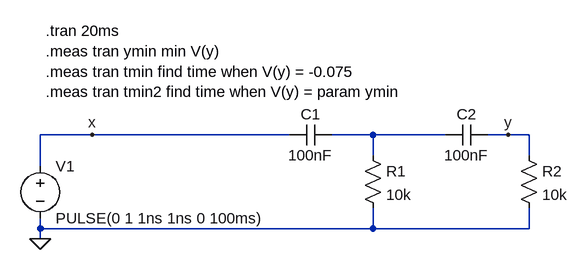
[diagram p0: schematic ltspice_high_high_series.asc]
ltspice_high_high_series.asc, the LTspice schematic file:
Version 4
SHEET 1 880 680
WIRE 16 112 -64 112
WIRE 320 112 16 112
WIRE 448 112 384 112
WIRE 560 112 448 112
WIRE 656 112 624 112
WIRE 688 112 656 112
WIRE 448 144 448 112
WIRE 688 144 688 112
WIRE -64 160 -64 112
WIRE -64 256 -64 240
WIRE 448 256 448 224
WIRE 448 256 -64 256
WIRE 688 256 688 224
WIRE 688 256 448 256
WIRE -64 272 -64 256
FLAG -64 272 0
FLAG 656 112 y
FLAG 16 112 x
SYMBOL res 432 128 R0
SYMATTR InstName R1
SYMATTR Value 10k
SYMBOL cap 320 128 R270
WINDOW 0 32 32 VTop 2
WINDOW 3 0 32 VBottom 2
SYMATTR InstName C1
SYMATTR Value 100nF
SYMBOL voltage -64 144 R0
WINDOW 123 0 0 Left 0
WINDOW 39 0 0 Left 0
SYMATTR InstName V1
SYMATTR Value PULSE(0 1 1ns 1ns 0 100ms)
SYMBOL res 672 128 R0
SYMATTR InstName R2
SYMATTR Value 10k
SYMBOL cap 560 128 R270
WINDOW 0 32 32 VTop 2
WINDOW 3 0 32 VBottom 2
SYMATTR InstName C2
SYMATTR Value 100nF
TEXT -56 -48 Left 2 !.tran 20ms\n.meas tran ymin min V(y)\n.meas tran tmin find time when V(y) = -0.075\n.meas tran tmin2 find time when V(y) = param ymin

The netlist it stands for:
* ltspice_high_high_series.asc
R1 N001 0 10k
C1 x N001 100nF
V1 x 0 PULSE(0 1 1ns 1ns 0 100ms)
R2 y 0 10k
C2 N001 y 100nF
.tran 20ms
.meas tran ymin min V(y)
.meas tran tmin find time when V(y) = -0.075
.meas tran tmin2 find time when V(y) = param ymin
.backanno
.end